# Altium schematic sheet PicoHAL.SchDoc: RP2040 CNC
size C; Author: AM; CompanyName: Expatria Technologies; DrawnBy: A.Marles; Engineer: AM; Organization: Expatria Technolgoies; Address1: Schematic; DocumentNumber: 2; SheetNumber: 2; SheetTotal: 5
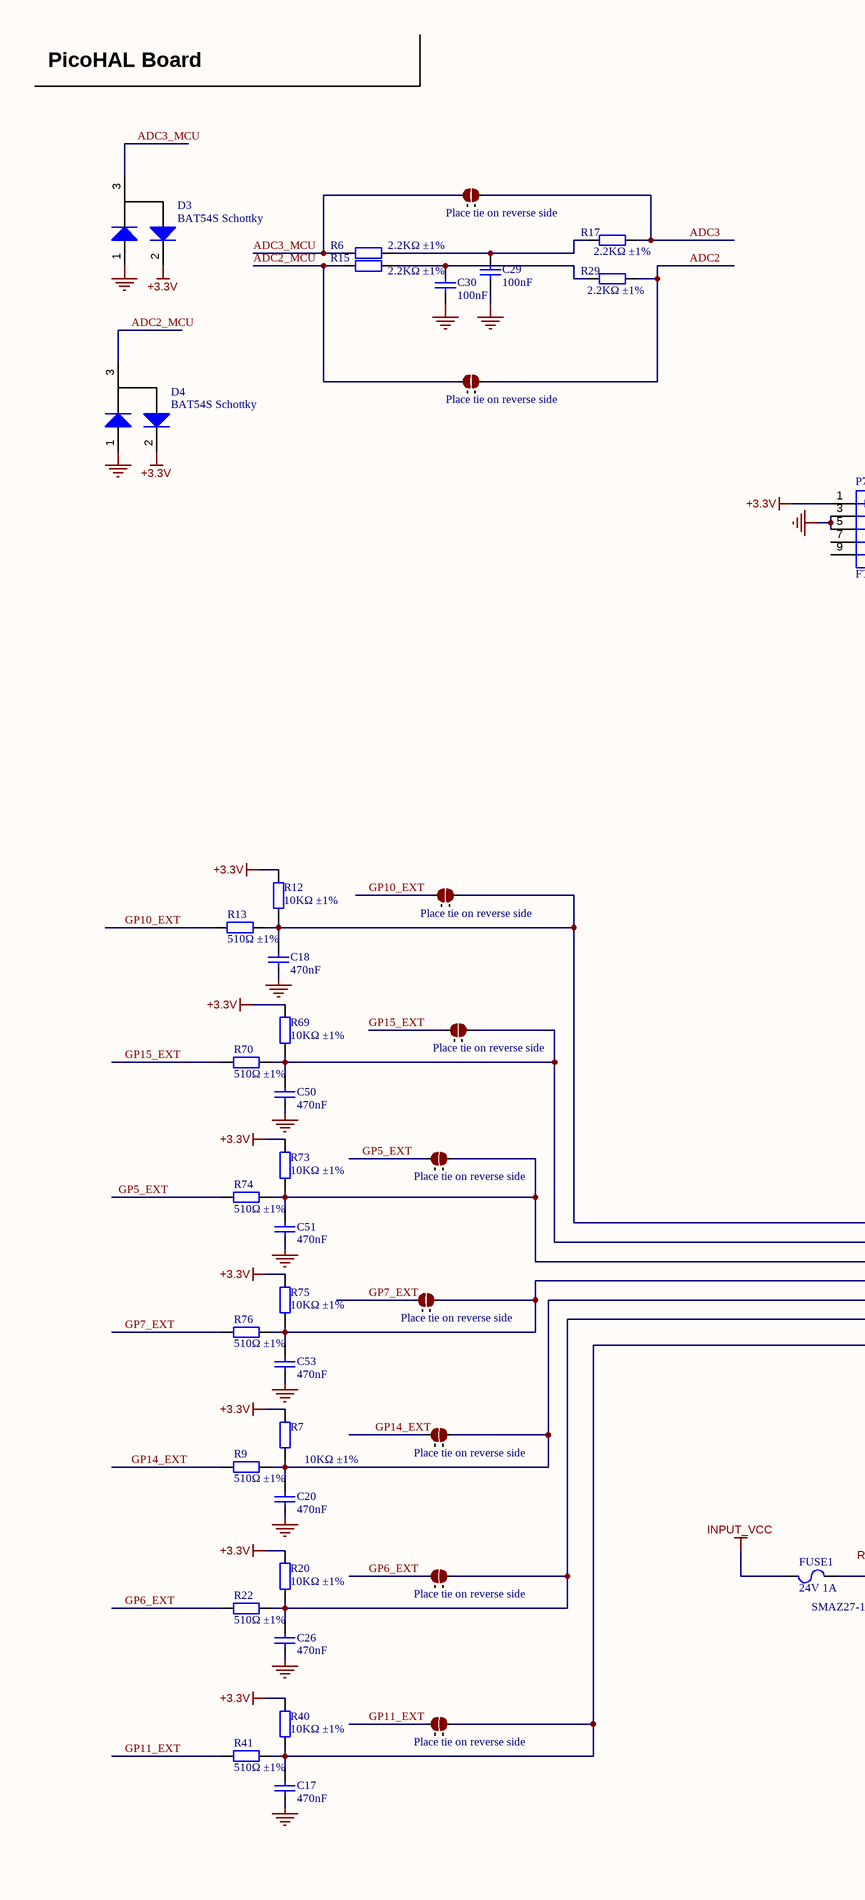
[diagram p0: PicoHAL.SchDoc, left]
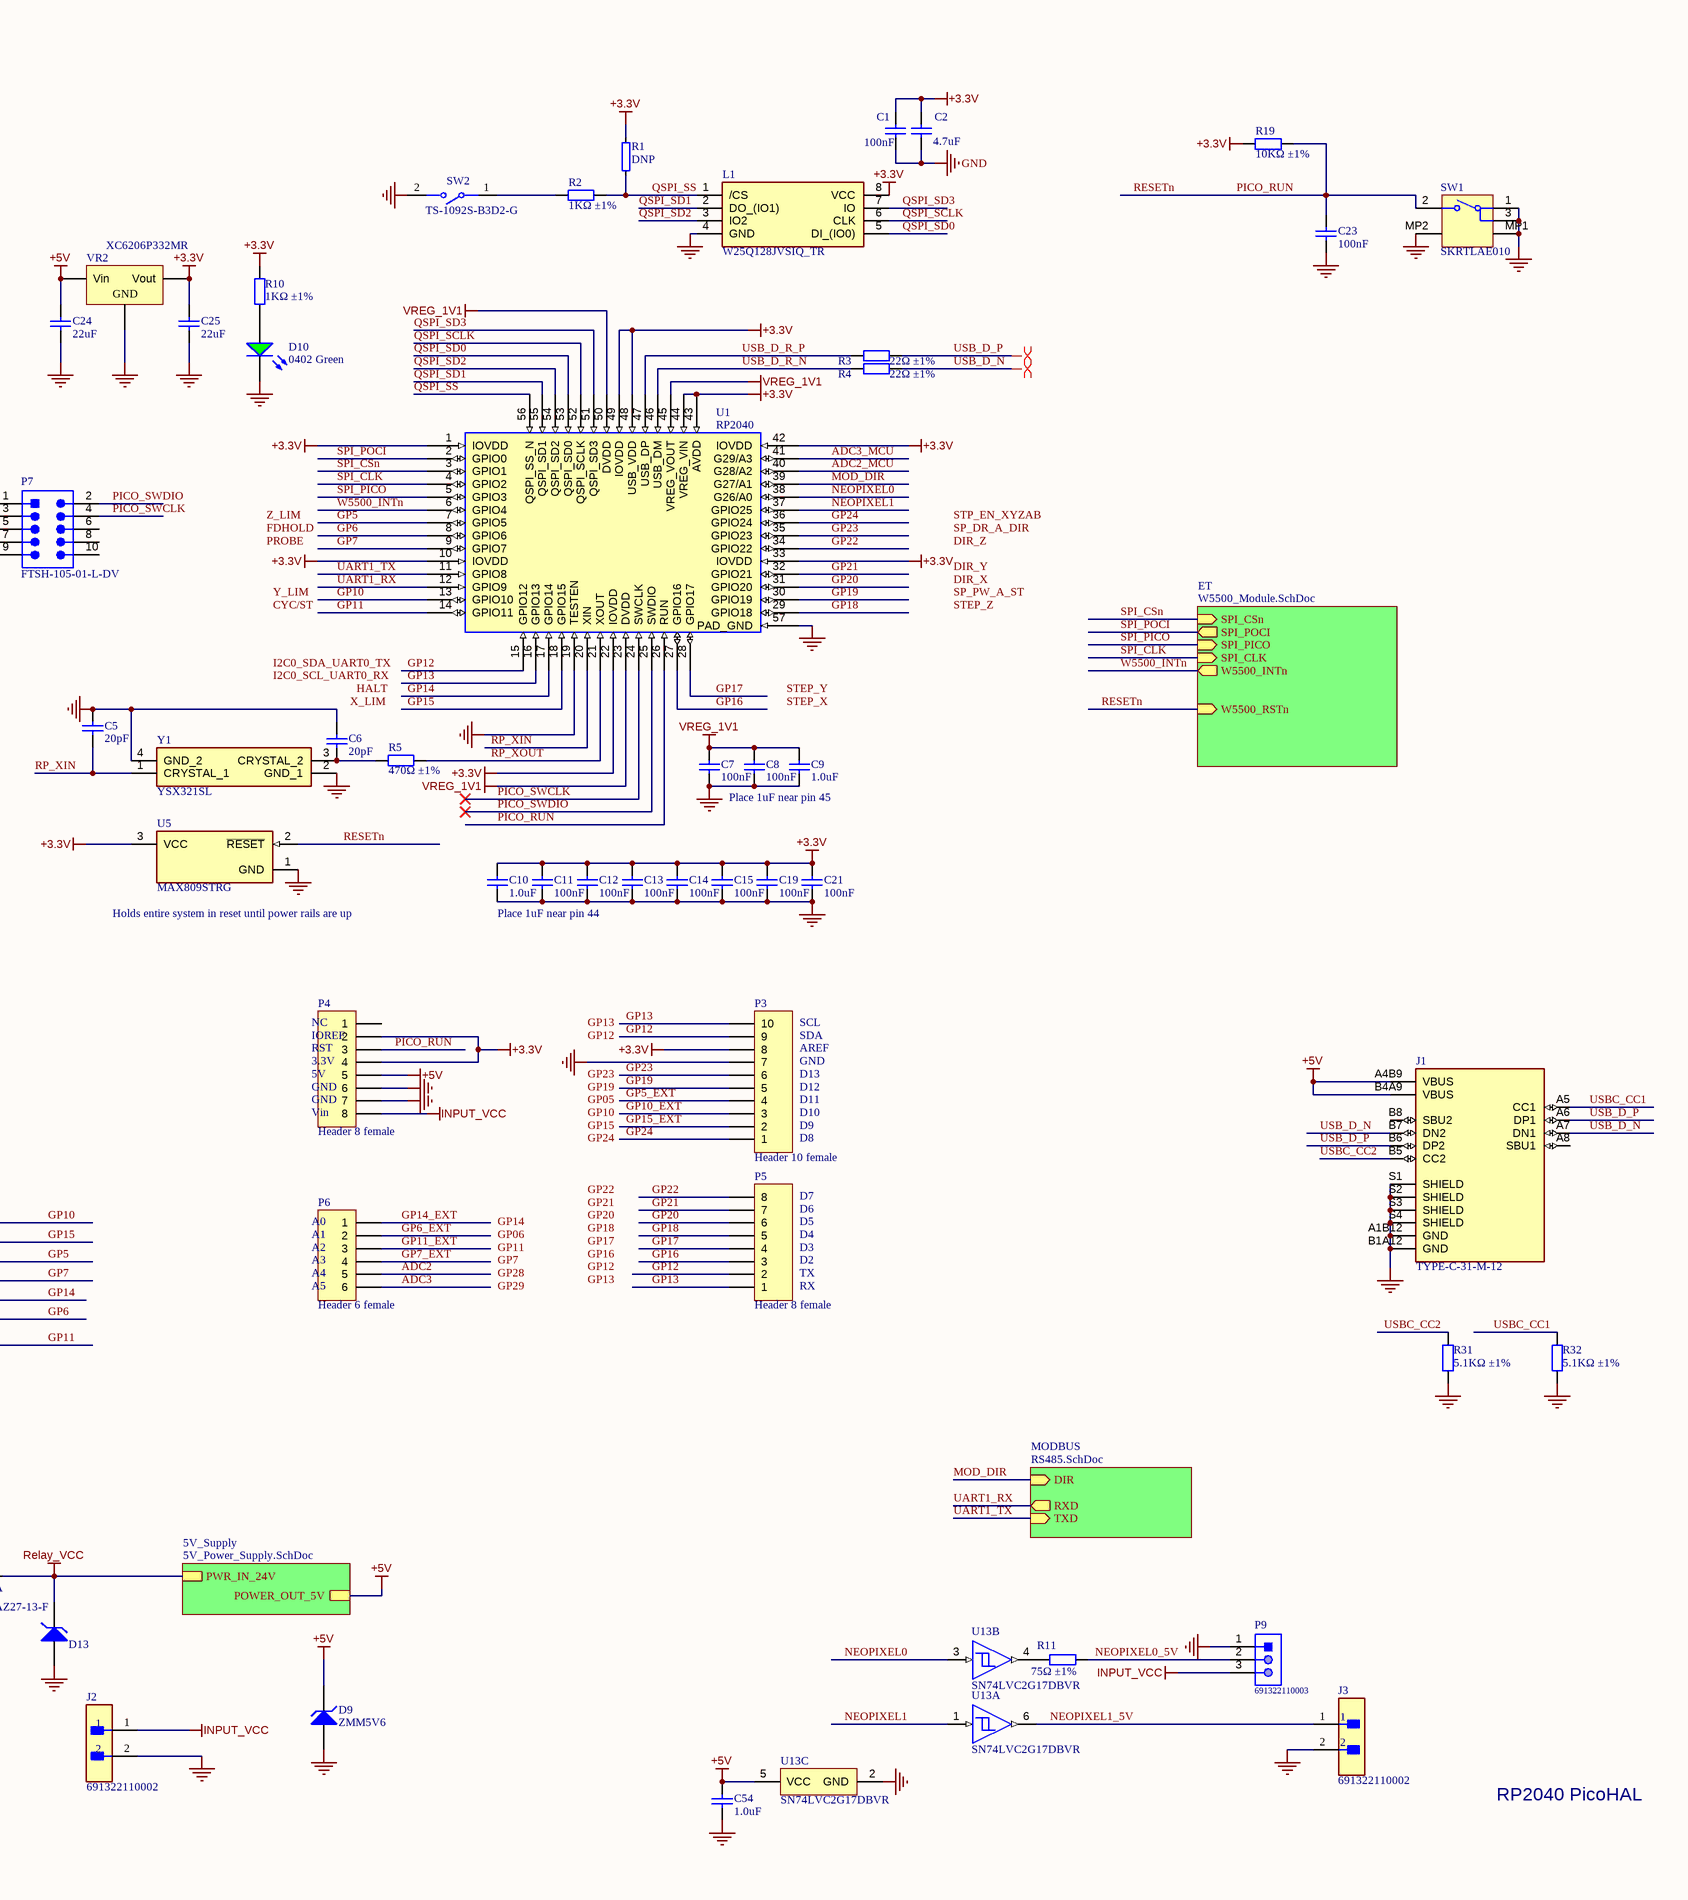
[diagram p1: PicoHAL.SchDoc, right]

## Parts
C1  100nF  [0402_C]
C2  4.7uF  [0402_C]
C5  20pF  [0402_C]
C6  20pF  [0402_C]
C7  100nF  [0402_C]
C8  100nF  [0402_C]
C9  1.0uF  [0402_C]
C10  1.0uF  [0402_C]
C11  100nF  [0402_C]
C12  100nF  [0402_C]
C13  100nF  [0402_C]
C14  100nF  [0402_C]
C15  100nF  [0402_C]
C17  470nF  [0402_C]
C18  470nF  [0402_C]
C19  100nF  [0402_C]
C20  470nF  [0402_C]
C21  100nF  [0402_C]
C23  100nF  [0402_C]
C24  22uF  [0805_C]
C25  22uF  [0805_C]
C26  470nF  [0402_C]
C29  100nF  [0402_C]
C30  100nF  [0402_C]
C50  470nF  [0402_C]
C51  470nF  [0402_C]
C53  470nF  [0402_C]
C54  1.0uF  [0402_C]
D3  BAT54S Schottky  [SOT-23(SOT-23-3)]
D4  BAT54S Schottky  [SOT-23(SOT-23-3)]
D9  ZMM5V6  [LL-34]
D10  0402 Green  [LED 0402_1005 RED]
D13  SMAZ27-13-F  [DIOM5226X240N]
FUSE1  24V 1A  [1206_C]
J1  TYPE-C-31-M-12  [HRO_TYPE-C-31-M-12]
J2  691322110002  [FP-691322110002-MFG]
J3  691322110002  [FP-691322110002-MFG]
J7  2 way net solder junction - Normally Open  [2waySolder_NO]  (value not drawn)  (no BOM)
J8  2 way net solder junction - Normally Open  [2waySolder_NO]  (value not drawn)  (no BOM)
J9  2 way net solder junction - Normally Open  [2waySolder_NO]  (value not drawn)  (no BOM)
J10  2 way net solder junction - Normally Open  [2waySolder_NO]  (value not drawn)  (no BOM)
J11  2 way net solder junction - Normally Open  [2waySolder_NO]  (value not drawn)  (no BOM)
J12  2 way net solder junction - Normally Open  [2waySolder_NO]  (value not drawn)  (no BOM)
J13  2 way net solder junction - Normally Open  [2waySolder_NO]  (value not drawn)  (no BOM)
J14  2 way net solder junction - Normally Open  [2waySolder_NO]  (value not drawn)  (no BOM)
J15  2 way net solder junction - Normally Open  [2waySolder_NO]  (value not drawn)  (no BOM)
L1  W25Q128JVSIQ_TR  [SOIC127P780X195-8N]
P3  Header 10 female  [HDR1X10]
P4  Header 8 female  [HDR1X8]
P5  Header 8 female  [HDR1X8]
P6  Header 6 female  [HDR1X6]
P7  FTSH-105-01-L-DV  [SMTC-FTSH-105-01-L-DV_V]  (no BOM)
P9  691322110003  [691322110003]
R1  DNP  [0402]
R2  1KΩ ±1%  [0402_R]
R3  22Ω ±1%  [0402_R]
R4  22Ω ±1%  [0402_R]
R5  470Ω ±1%  [0402_R]
R6  2.2KΩ ±1%  [0402_R]
R7  10KΩ ±1%  [0402_R]
R9  510Ω ±1%  [0402_R]
R10  1KΩ ±1%  [0402_R]
R11  75Ω ±1%  [0402_R]
R12  10KΩ ±1%  [0402_R]
R13  510Ω ±1%  [0402_R]
R15  2.2KΩ ±1%  [0402_R]
R17  2.2KΩ ±1%  [0402_R]
R19  10KΩ ±1%  [0402_R]
R20  10KΩ ±1%  [0402_R]
R22  510Ω ±1%  [0402_R]
R29  2.2KΩ ±1%  [0402_R]
R31  5.1KΩ ±1%  [0402_R]
R32  5.1KΩ ±1%  [0402_R]
R40  10KΩ ±1%  [0402_R]
R41  510Ω ±1%  [0402_R]
R69  10KΩ ±1%  [0402_R]
R70  510Ω ±1%  [0402_R]
R73  10KΩ ±1%  [0402_R]
R74  510Ω ±1%  [0402_R]
R75  10KΩ ±1%  [0402_R]
R76  510Ω ±1%  [0402_R]
SW1  SKRTLAE010  [ALPS-SKRTLAE010_V]
SW2  TS-1092S-B3D2-G  [SW-SMD_L6.1-W3.6-LS7.9]
U1  RP2040  [RP2040]
U5  MAX809STRG  [FP-318-08-MFG]
U13  SN74LVC2G17DBVR  [DBV0006A_N]  (parts A,B,C of 3)
VR2  XC6206P332MR  [SOT-23-3L]
Y1  YSX321SL  [YSX321SL]

## Sub-sheets
5V_Supply = 5V_Power_Supply.SchDoc: POWER_OUT_5V, PWR_IN_24V
ET = W5500_Module.SchDoc: SPI_CSn (in), SPI_POCI (out), W5500_RSTn (in), SPI_CLK (in), SPI_PICO (in), W5500_INTn (out)
MODBUS = RS485.SchDoc: RXD (out), TXD (in), DIR (in)

## Nets
+3.3V: C1.2 C2.2 C10.2 C11.2 C12.2 C13.2 C14.2 C15.2 C19.2 C21.2 C25.2 D3.2(A) D4.2(A) L1.8(VCC) P3.8 P4.2 P4.4 P7.1 R1.2 R7.2 R10.2 R12.2 R19.2 R20.2 R40.2 R69.2 R73.2 R75.2 U1.1(IOVDD) U1.10(IOVDD) U1.22(IOVDD) U1.33(IOVDD) U1.42(IOVDD) U1.43(AVDD) U1.44(VREG_VIN) U1.48(USB_VDD) U1.49(IOVDD) U5.3(VCC) VR2.2(Vout)
+5V: C24.2 C54.1 D9.2(K) J1.A4B9(VBUS) J1.B4A9(VBUS) P4.5 U13.5(VCC) VR2.3(Vin) ; sheet 5V_Supply/POWER_OUT_5V
GND: C1.1 C2.1 C5.2 C6.2 C7.1 C8.1 C9.1 C10.1 C11.1 C12.1 C13.1 C14.1 C15.1 C17.1 C18.1 C19.1 C20.1 C21.1 C23.1 C24.1 C25.1 C26.1 C29.1 C30.1 C50.1 C51.1 C53.1 C54.2 D3.1(A) D4.1(A) D9.1(A) D10.K D13.1(A) J1.A1B12(GND) J1.B1A12(GND) J1.S1(SHIELD) J1.S2(SHIELD) J1.S3(SHIELD) J1.S4(SHIELD) J2.2 J3.2 L1.4(GND) P3.7 P4.6 P4.7 P7.3 P7.5 P9.1 R31.2 R32.2 SW1.1 SW1.3 SW1.MP1 SW1.MP2 SW2.2 U1.19(TESTEN) U1.57(PAD_GND) U5.1(GND) U13.2(GND) VR2.1(GND) Y1.2(GND_1) Y1.4(GND_2)
INPUT_VCC: FUSE1.1 J2.1 P4.8 P9.3
Relay_VCC: D13.2(K) FUSE1.2 ; sheet 5V_Supply/PWR_IN_24V
VREG_1V1: C7.2 C8.2 C9.2 U1.23(DVDD) U1.45(VREG_VOUT) U1.50(DVDD)
ADC2: J8.2 P6.5 R29.2
ADC2_MCU: D4.3(K) J8.1 R15.1 U1.40(G28/A2)
ADC3: J7.2 P6.6 R17.2
ADC3_MCU: D3.3(K) J7.1 R6.1 U1.41(G29/A3)
GP5: C51.2 J11.2 R73.1 R74.2 U1.7(GPIO5)
GP5_EXT: J11.1 P3.4 R74.1
GP6: C26.2 J14.2 R20.1 R22.2 U1.8(GPIO6)
GP6_EXT: J14.1 P6.2 R22.1
GP7: C53.2 J12.2 R75.1 R76.2 U1.9(GPIO7)
GP7_EXT: J12.1 P6.4 R76.1
GP10: C18.2 J9.2 R12.1 R13.2 U1.13(GPIO10)
GP10_EXT: J9.1 P3.3 R13.1
GP11: C17.2 J15.2 R40.1 R41.2 U1.14(GPIO11)
GP11_EXT: J15.1 P6.3 R41.1
GP12: P3.9 P5.2 U1.15(GPIO12)
GP13: P3.10 P5.1 U1.16(GPIO13)
GP14: C20.2 J13.2 R7.1 R9.2 U1.17(GPIO14)
GP14_EXT: J13.1 P6.1 R9.1
GP15: C50.2 J10.2 R69.1 R70.2 U1.18(GPIO15)
GP15_EXT: J10.1 P3.2 R70.1
GP16: P5.3 U1.27(GPIO16)
GP17: P5.4 U1.28(GPIO17)
GP18: P5.5 U1.29(GPIO18)
GP19: P3.5 U1.30(GPIO19)
GP20: P5.6 U1.31(GPIO20)
GP21: P5.7 U1.32(GPIO21)
GP22: P5.8 U1.34(GPIO22)
GP23: P3.6 U1.35(GPIO23)
GP24: P3.1 U1.36(GPIO24)
MOD_DIR: U1.39(G27/A1) ; sheet MODBUS/DIR
NEOPIXEL0: U1.38(G26/A0) U13.3(2A)
NEOPIXEL0_5V: P9.2 R11.1
NEOPIXEL1: U1.37(GPIO25) U13.1(1A)
NEOPIXEL1_5V: J3.1 U13.6(1Y)
PICO_RUN: C23.2 P4.3 R19.1 SW1.2 U1.26(RUN) U5.2(~{RESET}) ; sheet ET/W5500_RSTn  [also labelled RESETn]
PICO_SWCLK: P7.4 U1.24(SWCLK)
PICO_SWDIO: P7.2 U1.25(SWDIO)
QSPI_SCLK: L1.6(CLK) U1.52(QSPI_SCLK)
QSPI_SD0: L1.5(DI_(IO0)) U1.53(QSPI_SD0)
QSPI_SD1: L1.2(DO_(IO1)) U1.55(QSPI_SD1)
QSPI_SD2: L1.3(IO2) U1.54(QSPI_SD2)
QSPI_SD3: L1.7(IO) U1.51(QSPI_SD3)
QSPI_SS: L1.1(/CS) R1.1 R2.2 U1.56(QSPI_SS_N)
RP_XIN: C5.1 U1.20(XIN) Y1.1(CRYSTAL_1)
RP_XOUT: R5.2 U1.21(XOUT)
SPI_CLK: U1.4(GPIO2) ; sheet ET/SPI_CLK
SPI_CSn: U1.3(GPIO1) ; sheet ET/SPI_CSn
SPI_PICO: U1.5(GPIO3) ; sheet ET/SPI_PICO
SPI_POCI: U1.2(GPIO0) ; sheet ET/SPI_POCI
UART1_RX: U1.12(GPIO9) ; sheet MODBUS/RXD
UART1_TX: U1.11(GPIO8) ; sheet MODBUS/TXD
USB_D_N: J1.A7(DN1) J1.B7(DN2) R4.1
USB_D_P: J1.A6(DP1) J1.B6(DP2) R3.1
USB_D_R_N: R4.2 U1.46(USB_DM)
USB_D_R_P: R3.2 U1.47(USB_DP)
USBC_CC1: J1.A5(CC1) R32.1
USBC_CC2: J1.B5(CC2) R31.1
W5500_INTn: U1.6(GPIO4) ; sheet ET/W5500_INTn
NetC6_1: C6.1 R5.1 Y1.3(CRYSTAL_2)
NetC29_2: C29.2 R6.2 R17.1
NetC30_2: C30.2 R15.2 R29.1
NetD10_A: D10.A R10.1
NetR2_1: R2.1 SW2.1
NetR11_2: R11.2 U13.4(2Y)

Not connected (* = marked no-connect by the designer): J1 A8(SBU1) B8(SBU2); P4 1; P7 6 7 8 9 10

## Layout directives
differential pair: USB_D_N, USB_D_P

## Notes on the sheet
- PicoHAL Board
- Place tie on reverse side
- (near J8) Place tie on reverse side
- Place 1uF near pin 45
- (near J9) Place tie on reverse side
- (near U5) Holds entire system in reset until power rails are up
- Place 1uF near pin 44
- (near J10) Place tie on reverse side
- (near P4) NC
- (near P4) IOREF
- (near P4) RST
- GP13
- GP12
- (near P3) AREF
- (near P3) SDA
- (near P3) SCL
- (near P4) 3.3V
- (near P4) 5V
- (near P4) GND
- GP23
- GP19
- GP05
- (near P3) GND
- (near P3) D13
- (near P3) D12
- (near P3) D11
- (near J11) Place tie on reverse side
- (near P4) Vin
- GP10
- GP15
- GP24
- (near P3) D10
- (near P3) D9
- D8
- (near P6) A0
- (near P6) A1
- GP14
- GP06
- GP22
- GP21
- GP20
- GP18
- D7
- (near P5) D6
- (near P5) D5
- (near P5) D4
- (near P6) A2
- (near P6) A3
- (near P6) A4
- (near P6) A5
- GP11
- GP7
- GP28
- GP29
- GP17
- GP16
- (near P5) D3
- (near P5) D2
- (near P5) TX
- (near P5) RX
- (near J12) Place tie on reverse side
- (near J13) Place tie on reverse side
- (near J14) Place tie on reverse side
- (near J15) Place tie on reverse side
- RP2040 PicoHAL
- Labels drawn without touching a wire or pin: CYC/ST, DIR_X, DIR_Y, DIR_Z, FDHOLD, HALT, I2C0_SCL_UART0_RX, I2C0_SDA_UART0_TX, PROBE, SP_DR_A_DIR, SP_PW_A_ST, STEP_X, STEP_Y, STEP_Z, STP_EN_XYZAB, X_LIM, Y_LIM, Z_LIM
- Expatria Technologies
- SHEET
- PROJECT
- REV
- 1136 Glade Court
- Port Coquitlam, BC V3B 1R5
- EMAIL: INFO@EXPATRIA.CA
- SIZE
- ENGR
- C
- MODIFIED
- DOCUMENT
- /
- Copyright Expatria Technologies 2023. This document describes Open Hardware and is licensed under the CERN-OHL-S v2. No warranty is implied or expressed.

## Library data of the parts
C1 C7 C8 C11-C15 C19 C21 C23 C29 C30 = 0402 100nF (104) 10% 16V: Chip capacitors; Manufacturer: Samsung Electro-Mechanics; PartNumber: CL05B104KO5NNNC; Tolerance: 10%; Voltage: 16V; ComponentLink1Description: Supplier link; ComponentLink1URL: http://www.szlcsc.com/product/details_1877.html; Package: 0402; Supplier: LC; SuppliersPartNumber: C1525; Capacitance: 100nF
C2 = 0402 4.7uF (475) 20% 10V: Chip capacitor; Manufacturer: Samsung Electro-Mechanics; PartNumber: CL05A475MP5NRNC; Tolerance: 20%; Voltage: 10V; ComponentLink1Description: Supplier link; ComponentLink1URL: http://www.szlcsc.com/product/details_24469.html; Package: 0402; Supplier: LC; SuppliersPartNumber: C23733; Capacitance: 4.7uF
C5 C6 = 0402 20pF (200) 5% 50V: Chip capacitors; Manufacturer: Guangdong Fenghua Advanced Tech; PartNumber: 0402CG200J500NT; Tolerance: 5%; Voltage: 50V; ComponentLink1Description: Supplier link; ComponentLink1URL: http://www.szlcsc.com/product/details_1906.html; Package: 0402; Supplier: LC; SuppliersPartNumber: C1554; Capacitance: 20pF
C9 C10 C54 = 0402 1.0uF (105) 10% 25V: Chip capacitor; Manufacturer: Samsung Electro-Mechanics; PartNumber: CL05A105KA5NQNC; Capacitance: 1uF; Tolerance: 10%; Voltage: 25V; ComponentLink1Description: Supplier link; ComponentLink1URL: http://www.szlcsc.com/product/details_53938.html; Package: 0402; Supplier: LC; SuppliersPartNumber: C52923
C17 C18 C20 C26 C50 C51 C53 = 0402 470nF (474) 10% 10V: Chip capacitors; Manufacturer: Samsung Electro-Mechanics; PartNumber: CL05A474KP5NNNC; Tolerance: 10%; Voltage: 10V; ComponentLink1Description: Supplier link; ComponentLink1URL: http://www.szlcsc.com/product/details_48344.html; Package: 0402; Supplier: LC; SuppliersPartNumber: C47339; Capacitance: 470nF
C24 C25 = 0805 22uF (226) 20% 25V: Chip capacitors; Manufacturer: Samsung Electro-Mechanics; PartNumber: CL21A226MAQNNNE; Tolerance: 20%; Voltage: 25V; Package: 0805; Supplier: LC; SuppliersPartNumber: C2922481; Capacitance: 22uF; ComponentLink1Description: Supplier link; ComponentLink1URL: http://www.szlcsc.com/product/details_46786.html
D3 D4 = SOT-23 BAT54S: 30V Dual 200mA 800mV@100mA SOT-23 Schottky Barrier Diodes (SBD) ROHS; ComponentLink1Description: 供应商链接; ComponentLink1URL: http://www.szlcsc.com/product/details_2877.html; Package: SOT-23; Supplier: LC; SuppliersPartNumber: C916425
D9 = LL-34 ZMM5V6: 500mW - 0.1uA @ 1V 5.6V LL-34 Zener Diodes ROHS; ComponentLink1Description: 供应商链接; ComponentLink1URL: http://www.szlcsc.com/product/details_8541.html; Package: LL-34; Supplier: LC; SuppliersPartNumber: C8062
D10 = 0402 LED Green: LED; Package: 0402; Supplier: LC; SuppliersPartNumber: C130723; Color: Green
D13 = BZT52C27: 27V ±5% 1W 500nA @ 20.5V SMA(DO-214AC) Zener Diodes RoHS; ComponentLink1Description: 供应商链接; ComponentLink1URL: http://www.szlcsc.com/product/details_8541.html; Package: SMA(DO-214AC); Supplier: LC; SuppliersPartNumber: C155318
FUSE1 = JK-nSMD050-24: 24V 1A 0.1s 1206 PTC Resettable Fuses RoHS; Manufacturer: Jinrui Electronic Materials Co.; Package: 1206; Supplier: LC; SuppliersPartNumber: C369160; PartNumber: JK-nSMD050-24
J1 = TYPE-C-31-M-12: USB Connectors 24 Receptacle 1 8.94*7.3mm RoHS; MF: HRO Electronics Co., Ltd.; Value: *; SnapEDA_Link: https://www.snapeda.com/parts/TYPE-C-31-M-12/HRO%20Electronics%20Co.,%20Ltd./view-part/3228496/?ref=snap; Package: Package; MP: TYPE-C-31-M-12; Price: None; Availability: Unavailable; SuppliersPartNumber: C165948
J2 = CMP-1502-01791-2: TERM BLOCK HDR 2POS 90DEG 3.5MM; Voltage: 300V; Current: 10A; Number of Levels: 1; Number of Positions: 2; Length: 10.5mm; Pitch: 3.5mm; Color: Green; Mount: Through Hole; Package Quantity: 1000; Series: WR-TBL Series 3221; Contact Material: Brass; RoHS Compliant: Yes; Width: 8.1mm; Housing Material: Nylon; Flammability Rating: UL94 V-0; Lead Free: Lead Free; Termination: Solder; Number of Contacts: 2; Packaging: Bulk; Number of Rows: 1; Height: 9.2mm; Number of Positions Per Level: 2; SuppliersPartNumber: C395830
J3 = CMP-1502-01791-2: TERM BLOCK HDR 2POS 90DEG 3.5MM; SuppliersPartNumber: C880572
J7-J15 = 2waySolderNO: ComponentLink1URL: http://www.edatools.cz/addons; ComponentLink1Description: Source
L1 = W25Q128JVSIQ_TR: Inductor; Manufacturer_Name: Winbond; Manufacturer_Part_Number: W25Q128JVSIQ TR; Datasheet Link: http://www.winbond.com/resource-files/w25q128jv%20spi%20revc%2011162016.pdf; Height: 1.95mm; Mouser Part Number: 454-W25Q128JVSIQTR; Mouser Price/Stock: https://www.mouser.co.uk/ProductDetail/Winbond/W25Q128JVSIQ-TR?qs=qSfuJ%252Bfl%2Fd7vTyLA9kNdGw%3D%3D; Arrow Part Number: W25Q128JVSIQ TR; Arrow Price/Stock: https://www.arrow.com/en/products/w25q128jvsiqtr/winbond-electronics?region=nac; SuppliersPartNumber: C97521
P3 = Header 10: Header, 10-Pin; LatestRevisionDate: 17-Jul-2002; LatestRevisionNote: Re-released for DXP Platform.; Publisher: Altium Limited; SuppliersPartNumber: C2905418
P4 P5 = Header 8: Header, 8-Pin; LatestRevisionDate: 17-Jul-2002; LatestRevisionNote: Re-released for DXP Platform.; Publisher: Altium Limited; SuppliersPartNumber: C27438
P6 = Header 6: Header, 6-Pin; LatestRevisionDate: 17-Jul-2002; LatestRevisionNote: Re-released for DXP Platform.; Publisher: Altium Limited; SuppliersPartNumber: C40877
P7 = CMP-2000-05354-1: Male Header, Pitch 1.27 mm, 2 x 5 Position, Height 5.96 mm, -55 to 125 degC, RoHS, Bulk; Manufacturer: Samtec; Connector Type: Header,Unshrouded; Pitch: 0.050"(1.27mm); Mating Products: FLE-105-01-G-DV-TR-ND-CONNSKT1.27MM10POSDUALSMDCLP-105-02-G-D-P-TR-ND-CONNRCPT10POSDUAL.05"SMDSFMC-105-L2-S-D-TR-ND-CONN.05"SURFACE10POSSMTSFMH-105-02-L-D-TR-ND-CONNRECEPT10POS.50"SMTFLE-105-01-G-DV-A-ND-CONNSKT1.27MM10POSDUALSMDCLP-105-02-G-D-BE-ND-CONNRCPT10POSDUAL.05"SMDFLE-105-01-G-DV-A-P-ND-CONNSKT1.27MM10POSDUALSMDSAM1153-05-ND-CONNRCPT10POSDUAL.05"SMDSAM1155-05-ND-CONNRCPT10POSDUAL.05"SMDSAM1154-05-ND-CONNRCPT10POSDUAL.05"SMDSFMH-105-02-L-D-LC-ND-CONNRECEPT10POS.50"SMTSAM1226-05-ND-CONNRCPT.05"10POSDUALSMD; Catalog Drawings: FTSHSeriesFTSHSeriesSMTSide; Other Names: SAM1161-05; EDA / CAD Models: DownloadfromAcceleratedDesigns; Number of Positions Loaded: All; Number of Positions: 10; Featured Product: Board-To-BoardInterconnectSystems; Online Catalog: FTSHSeries; Product Training Modules: Board-to-BoardConnectors; Category: Connectors,Interconnects; Number of Rows: 2; Contact Finish: Gold; Termination: Solder; Mounting Type: SurfaceMount; Series: FTSH; Contact Mating Length: 0.120"(3.05mm); Row Spacing: 0.050"(1.27mm); Datasheet URL: https://datasheet.ciiva.com/30493/0900766b80adfe36-30493006.pdf; Contact Finish Thickness: 10µin(0.25µm); Features: -; Standard Package: 1; Packaging: Bulk; Datasheet Version: Feb-08; Manufacturer URL: http://www.samtec.com/; Fastening Type: -; Family: RectangularConnectors-Headers,MalePins; Contact Type: MalePin; Color: Black
P9 = CMP-1502-01792-1: Serie 3221 - 3.50mm Horizontal PCB Header WR-TBL, 3 pin; SuppliersPartNumber: C880573
R1 = RES: Resistor, ±5%, 0.05W; Part Number: R0201-0R; Part number IPS: 00000003245; Value: 0R; Note: Chip Res 5%; Artikkelnr Noca: N.A.; Manufacturer: *; Manufacturer Part Number: *; ComponentLink1URL: *; ComponentLink1Description: Datasheet; ComponentLink2URL: *; ComponentLink2Description: Supplier link; HelpURL: *; Footprint Doc: 0201; LatestRevisionDate: 2017-11-09; Pin Count: 2; Publisher: Nordic Semiconductor; Published: 2014-11-13; Supplier 1: *; Supplier Part Number 1: *; Supplier 2: *; Supplier Part Number 2: *
R2 R10 = 0402 1K (1001) 1%: Chip resistor; Manufacturer: Uniroyal Elec; PartNumber: 0402WGF1001TCE; Power: 1/16W; ComponentLink1Description: Supplier link; ComponentLink1URL: http://www.szlcsc.com/product/details_12256.html; Package: 0402; Supplier: LC; SuppliersPartNumber: C11702; Resistance: 1KΩ; Tolerance: 1%
R3 R4 = 0402 22R (22R0) 1%: Chip resistor; Manufacturer: Uniroyal Elec; PartNumber: 0402WGF220JTCE; Power: 1/16W; ComponentLink1Description: Supplier link; ComponentLink1URL: http://www.szlcsc.com/product/details_25835.html; Package: 0402; Supplier: LC; SuppliersPartNumber: C25092; Resistance: 22Ω; Tolerance: 1%
R5 = 0402 470R (4700) 1%: Chip resistor; Manufacturer: Uniroyal Elec; PartNumber: 0402WGF4700TCE; Power: 1/16W; ComponentLink1Description: Supplier link; ComponentLink1URL: http://www.szlcsc.com/product/details_25860.html; Package: 0402; Supplier: LC; SuppliersPartNumber: C25117; Resistance: 470Ω; Tolerance: 1%
R6 R15 R17 R29 = 0402 2.2K (2201) 1%: Chip resistor; Manufacturer: Uniroyal Elec; PartNumber: 0402WGF2201TCE; Power: 1/16W; ComponentLink1Description: Supplier link; ComponentLink1URL: http://www.szlcsc.com/product/details_26622.html; Package: 0402; Supplier: LC; SuppliersPartNumber: C25879; Resistance: 2.2KΩ; Tolerance: 1%
R7 R12 R19 R20 R40 R69 R73 R75 = 0402 10K (1002) 1%: Chip resistor; Manufacturer: Uniroyal Elec; PartNumber: 0402WGF1002TCE; Power: 1/16W; ComponentLink1Description: Supplier link; ComponentLink1URL: http://www.szlcsc.com/product/details_26487.html; Package: 0402; Supplier: LC; SuppliersPartNumber: C25744; Resistance: 10KΩ; Tolerance: 1%
R9 R13 R22 R41 R70 R74 R76 = 0402 510R (5100) 1%: Chip resistor; Manufacturer: Uniroyal Elec; PartNumber: 0402WGF5100TCE; Power: 1/16W; ComponentLink1Description: Supplier link; ComponentLink1URL: http://www.szlcsc.com/product/details_25866.html; Package: 0402; Supplier: LC; SuppliersPartNumber: C25123; Resistance: 510Ω; Tolerance: 1%
R11 = 0402 75R (75R0) 1%: Chip resistor; Manufacturer: Uniroyal Elec; PartNumber: 0402WGF750JTCE; Power: 1/16W; ComponentLink1Description: Supplier link; ComponentLink1URL: http://www.szlcsc.com/product/details_25876.html; Package: 0402; Supplier: LC; SuppliersPartNumber: C25133; Resistance: 75Ω; Tolerance: 1%
R31 R32 = 0402 5.1K (5101) 1%: Chip resistor; Manufacturer: Uniroyal Elec; PartNumber: 0402WGF5101TCE; Power: 1/16W; Resistance: 51.1KΩ; ComponentLink1Description: Supplier link; ComponentLink1URL: http://www.szlcsc.com/product/details_26648.html; Package: 0402; Supplier: LC; SuppliersPartNumber: C25905; Tolerance: 1%
SW1 = CMP-2000-07073-2: Side Push Type, 250 V, -40 to 90 degC, 3-Pin SMD, RoHS, Tape and Reel; Manufacturer: ALPS; Operating Force: 1.6N; Folder: Unified Components\Components\New Releases\New\; Maximum Current Rating: 0.05@12VDCA; RevisionId: 1; Pole Throw Configuration: SPST; Switch Configuration: N.O.; AccessRights: 2147483647; Maximum DC Voltage Rating: 12V; ContentType: Unified Component; Rad Hard: No; Mounting: SurfaceMount; Datasheet URL: http://www.alps.com/prod/info/E/PDF/Tact/SurfaceMount/SKRT/SKRT.PDF; Manufacturer URL: http://www.alps.com/e/; ReleaseDate: 22/09/2017 06:13:25 AM; ItemHRID: CMP-2000-07073; ContentTypeGUID: CB3C11C4-E317-11DF-B822-12313F0024A2; LifeCycle: Released; ItemGUID: EAC55BEC-37DC-4BDB-8BA7-D75E6D5C3D75; Packaging: Tape&Reel; Package Reference: SKRTLAE010; FolderGUID: B7F4506A-9127-42E7-A087-46FE7B18D116; Datasheet Version: 06/2015; Mounting Technology: SurfaceMount; LifeCycleStateGUID: 61E382EE-6656-4F12-9E24-BE9327104A25; Package Description: 3-Pin Surface Mount Device, Body 4.5 x 3.55 mm, Pitch 1.225 mm; SuppliersPartNumber: C110293
SW2 = TS-1092S-B3D2-G: Tactile Switches  3.6mm 2.5mm Rectangle button Brick nogging SPST 6.1mm 250gf SMD ROHS; Manufacturer 1: Yuandi; Width: 3.5mm; Size: 6.1mm; Manufacturer Part Number 1: TS-1092S-B3D2-G; SuppliersPartNumber: C520860
U1 = RP2040: RP2040 First MCU from RPI; SuppliersPartNumber: C2040
U5 = CMP-07130-000007-1: IC MPU SUPERVISORY 2.93V SOT23; Manufacturer: ON SEMICONDUCTOR; Number Of Outputs: 1; Nominal Supply Current: 0.5-0.8uA; Min Supply Voltage: 1V; Max Junction Temp: +125°C; Max Supply Voltage: 5.5V; Reset Timeout: 10us; Output Current: 20mA; Output Voltage: 0.3V; Reset Type: Active Low; Standoff Height: 0.01mm; Octopart: https://octopart.com/max809strg-on+semiconductor-509853; Category: IC; Temperature: -40°C to +125°C; Temperature Range Low: -40°C; ComponentLink2URL: https://www.onsemi.cn/PowerSolutions/document/MAX809S-D.PDF; Device Class L1: Integrated Circuits (ICs); Automotive: No; Package: 318-08; Device Class L2: Power Management ICs; RoHS: TRUE; Height: 1.11mm; Digikey Description: IC MPU SUPERVISORY 2.93V SOT23; Mouser Description: Supervisory Circuits 2.93V uP Reset; ComponentLink2Description: Datasheet; Manufacturer Part Number: MAX809STRG; Temperature Range High: +125°C; Number Of Rails Monitored: 1; Threshold Voltage: 2.93V; Footprint Url: https://www.onsemi.com/pub/Collateral/318-08.PDF; Device Class L3: Voltage Supervisors; Lead Free: Yes; SuppliersPartNumber: C9965
U13 = CMP-0859-00225-4: Dual Schmitt-Trigger Buffer, DBV0006A, LARGE T&R; Manufacturer: Texas Instruments; F @ Nom Voltage(Max)(Mhz): 150; VCC(Max)(V): 5.5; tpd @ Nom Voltage(Max)(ns): 9.3,5.7,5.4,4.3; Sub-Family: Non-Inverting Buffer/Driver; Output Drive (IOL/IOH)(Max)(mA): 32/-32; Output Type: CMOS; Voltage(Nom)(V): 1.8,2.5,3.3,5; ICC @ Nom Voltage(Max)(mA): 0.01; Schmitt Trigger: Yes; Technology Family: LVC; VCC(Min)(V): 1.65; 3-State Output: No; Rating: Catalog; Bits(#): 2; Input Type: CMOS/TTL; Logic: True; DatasheetVersion: SCES381N; Generic Part Number: SN74LVC2G17; PackageReference: DBV0006A; Operating Temperature Range(C): -40 to 125,-40 to 85; SuppliersPartNumber: C10429
VR2 = SOT-23 XC6206P332MR: 200mA 680mV@(100mA) Fixed 3.3V~3.3V Positive 1 6V SOT-23-3L Linear Voltage Regulators (LDO) ROHS; ComponentLink1Description: 供应商链接; ComponentLink1URL: http://www.szlcsc.com/product/details_5896.html; Package: SOT-23; Supplier: LC; SuppliersPartNumber: C5446
Y1 = YSX321SL: Crystal or Oscillator; Manufacturer_Name: YXC; Datasheet Link: https://datasheet.lcsc.com/szlcsc/YSX321SL-30MHZ-10PF-8PPM_C70576.pdf; Height: 0.8mm; Manufacturer_Part_Number: YSX321SL; SuppliersPartNumber: C9002